# Altium project Motor-42.PrjPCB
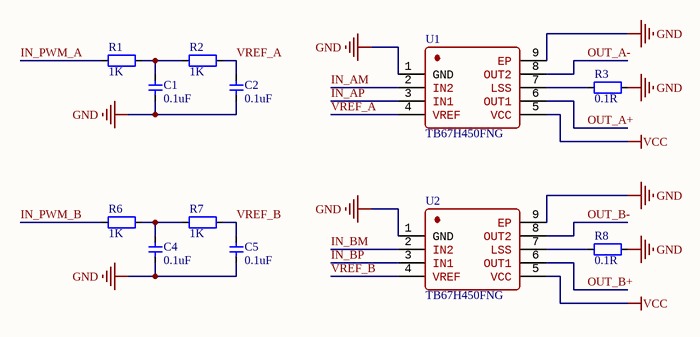
[diagram p0: Drive.SchDoc]
5 sheets, 59 parts. Net scope: global (net labels, ports and power ports of the same name join across sheets).
Board file: Motor-42.PcbDoc
Sheets:
  Drive.SchDoc
  MCU.SchDoc
  Port.SchDoc
  Power.SchDoc
  Interface.SchDoc

## Sheet Drive.SchDoc
size 177 x 101 mm; SheetNumber: 1; SheetTotal: 1

### Parts
C1  0.1uF  [CAP_0402]
C2  0.1uF  [CAP_0402]
C4  0.1uF  [CAP_0402]
C5  0.1uF  [CAP_0402]
R1  1K  [RES_0402]
R2  1K  [RES_0402]
R3  0.1R  [1206-RES]
R6  1K  [RES_0402]
R7  1K  [RES_0402]
R8  0.1R  [1206-RES]
U1  TB67H450FNG  [SO-8-PAD]
U2  TB67H450FNG  [SO-8-PAD]

### Nets
GND: C1.1 C2.1 C4.1 C5.1 R3.2 R8.2 U1.1(GND) U1.9(EP) U2.1(GND) U2.9(EP)
VCC: U1.5(VCC) U2.5(VCC)
IN_AM: U1.2(IN2)
IN_AP: U1.3(IN1)
IN_BM: U2.2(IN2)
IN_BP: U2.3(IN1)
IN_PWM_A: R1.1
IN_PWM_B: R6.1
OUT_A+: U1.6(OUT1)
OUT_A-: U1.8(OUT2)
OUT_B+: U2.6(OUT1)
OUT_B-: U2.8(OUT2)
VREF_A: C2.2 R2.2 U1.4(VREF)
VREF_B: C5.2 R7.2 U2.4(VREF)
NetC1_2: C1.2 R1.2 R2.1
NetC4_2: C4.2 R6.2 R7.1
NetR3_1: R3.1 U1.7(LSS)
NetR8_1: R8.1 U2.7(LSS)

### Library data of the parts
C1 C2 C4 C5 = 电容-0402: Capacitor; Value: 0.1u
R1 R2 R6 R7 = 电阻-0402: Resistor; Value: 22R
R3 R8 = 电阻-1206: Resistor; Value: 22R
U1 U2 = TB67H450FNG: PWM Chopper Type DC Brushed Motor Driver

## Sheet MCU.SchDoc
size 177 x 114 mm; SheetNumber: 1; SheetTotal: 1
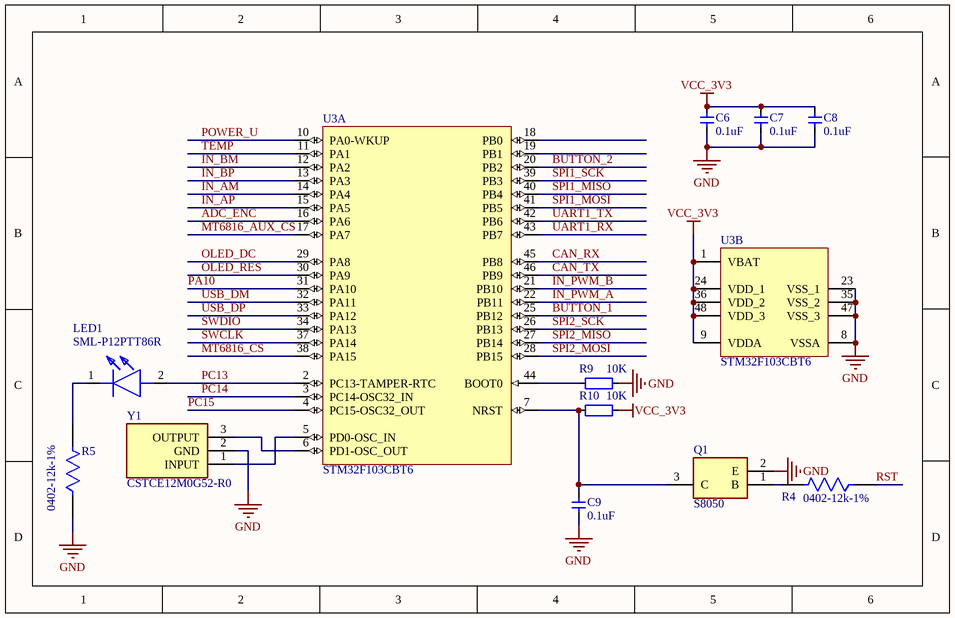
[diagram p1: MCU.SchDoc]

### Parts
C6  0.1uF  [CAP_0402]
C7  0.1uF  [CAP_0402]
C8  0.1uF  [CAP_0402]
C9  0.1uF  [CAP_0402]
LED1  SML-P12PTT86R  [LEDC1006X25N]
Q1  S8050  [SOT95P240X115-3N]
R4  0402-12k-1%  [FP-CRCW0402-e3-IPC_C]
R5  0402-12k-1%  [FP-CRCW0402-e3-IPC_C]
R9  10K  [RES_0402]
R10  10K  [RES_0402]
U3  STM32F103CBT6  [LQFP-48]  (parts A,B of 2)
Y1  CSTCE12M0G52-R0  [CSTCE12M0G52R0]

### Nets
GND: C6.1 C7.1 C8.1 C9.1 Q1.2(E) R5.1 R9.2 U3.8(VSSA) U3.23(VSS_1) U3.35(VSS_2) U3.47(VSS_3) Y1.2(GND)
VCC_3V3: C6.2 C7.2 C8.2 R10.2 U3.1(VBAT) U3.9(VDDA) U3.24(VDD_1) U3.36(VDD_2) U3.48(VDD_3)
ADC_ENC: U3.16(PA6)
BUTTON_1: U3.25(PB12)
BUTTON_2: U3.20(PB2)
CAN_RX: U3.45(PB8)
CAN_TX: U3.46(PB9)
IN_AM: U3.14(PA4)
IN_AP: U3.15(PA5)
IN_BM: U3.12(PA2)
IN_BP: U3.13(PA3)
IN_PWM_A: U3.22(PB11)
IN_PWM_B: U3.21(PB10)
MT6816_AUX_CS: U3.17(PA7)
MT6816_CS: U3.38(PA15)
OLED_DC: U3.29(PA8)
OLED_RES: U3.30(PA9)
PA10: U3.31(PA10)
PC13: LED1.2(A) U3.2(PC13-TAMPER-RTC)
PC14: U3.3(PC14-OSC32_IN)
PC15: U3.4(PC15-OSC32_OUT)
POWER_U: U3.10(PA0-WKUP)
RST: R4.1
SPI1_MISO: U3.40(PB4)
SPI1_MOSI: U3.41(PB5)
SPI1_SCK: U3.39(PB3)
SPI2_MISO: U3.27(PB14)
SPI2_MOSI: U3.28(PB15)
SPI2_SCK: U3.26(PB13)
SWCLK: U3.37(PA14)
SWDIO: U3.34(PA13)
TEMP: U3.11(PA1)
UART1_RX: U3.43(PB7)
UART1_TX: U3.42(PB6)
USB_DM: U3.32(PA11)
USB_DP: U3.33(PA12)
NetC9_2: C9.2 Q1.3(C) R10.1 U3.7(NRST)
NetLED1_1: LED1.1(K) R5.2
NetQ1_1: Q1.1(B) R4.2
NetR9_1: R9.1 U3.44(BOOT0)
NetU3_5: U3.5(PD0-OSC_IN) Y1.1(INPUT)
NetU3_6: U3.6(PD1-OSC_OUT) Y1.3(OUTPUT)

Not connected (* = marked no-connect by the designer): U3 18(PB0) 19(PB1)

### Library data of the parts
C6-C9 = 电容-0402: Capacitor; Value: 0.1u
LED1 = SML-P12PTT86R: LED; Manufacturer_Name: ROHM Semiconductor; Datasheet Link: https://componentsearchengine.com/Datasheets/2/SML-P12PTT86R.pdf; Height: 0.25mm; Manufacturer_Part_Number: SML-P12PTT86R; Mouser Part Number: 755-SML-P12PTT86R; Mouser Price/Stock: https://www.mouser.co.uk/ProductDetail/ROHM-Semiconductor/SML-P12PTT86R?qs=Ei%2Fnxee9QYifz6HhDm1g1Q%3D%3D
Q1 = S8050: Transistor; Manufacturer_Name: Yenji Elec; Datasheet Link: https://datasheet.lcsc.com/szlcsc/Yenji-Elec-S8050_C139514.pdf; Height: 1.15mm; Manufacturer_Part_Number: S8050
R4 R5 = CMP-2002-08122-2: RES Thick Film, 0Ω, 0.063W, 0402; Tolerance: 5%; Max Power Dissipation: 63mW; Voltage Rating: 50V; Temperature Coefficient: 100ppm/°C; Resistance: 0mR; Contact Plating: Tin; Height: 0.35mm; Radiation Hardening: No; Features: Automotive AEC-Q200; Composition: Thick Film; Width: 0.5mm; Weight: 2.3E-05oz; Termination: SMD/SMT; Packaging: Tape and Reel; Mount: Surface Mount; Case Code (Metric): 1005; Military Standard: Not; Min Operating Temperature: -55°C; Number of Terminations: 2; Package Quantity: 1; Case Code (Imperial): 0402; Depth: 0.5mm; Max Operating Temperature: 155°C; Case/Package: 0402; Power Rating: 63mW; Lead Free: Lead Free; Voltage Rating (DC): 50V; Length: 1mm
R9 R10 = 电阻-0402: Resistor; Value: 22R
U3 = STM32F103CBT6: ARM Cortex-M3 32-bit MCU, 128 KB Flash, 20 KB Internal RAM, 37 I/Os, 48-pin LQFP, -40 to 85 degC, Tray; A/D Converter: 2x12-bit (10 Channel); FLASH Size (Prog) (kB): 128; I/Os (High Current): 37; Internal RAM Size (kB): 20; Operating Frequency(F) (Processor speed) (MHz): 72; Supply Voltage(Vcc) min (V): 2; DatasheetVersion: Rev. 16; PackageVersion: Rev. 6, 06/2013; PackageReference: LQFP48; PackageDescription: 48-Pin Low Profile Quad Flat Package, 7 x 7 mm Body, 0.5 mm Pitch; Supplier 1: Digi-Key; Supplier Part Number 1: 497-6288-ND; Supplier 2: Farnell; Supplier Part Number 2: 1606327; Supplier 3: Newark; Supplier Part Number 3: 11N8296; Supplier 4: Newark; Supplier Part Number 4: 57P1214; Supplier 5: Mouser; Supplier Part Number 5: 511-STM32F103CBT6; Core: ARM Cortex-M3; Packing: Tray; Mounting Technology: Surface Mount; PartNumber: STM32F103CBT6; ComponentLink1Description: Manufacturer URL; ComponentLink1URL: http://www.st.com/web/en/home.html; ComponentLink2Description: Datasheet; ComponentLink2URL: http://www.st.com/st-web-ui/static/active/en/resource/technical/document/datasheet/CD00161566.pdf; ComponentLink3Description: Package Specification; ComponentLink3URL: http://www.st.com/st-web-ui/static/active/en/resource/technical/document/datasheet/DM00058181.pdf
Y1 = CSTCE12M0G52-R0: Crystal or Oscillator; Manufacturer_Name: Murata Electronics; Datasheet Link: https://www.murata.com/en-global/products/productdata/8801428045854/SPEC-CSTNE12M0G520000R0.pdf; Height: 0.8mm; Manufacturer_Part_Number: CSTCE12M0G52-R0; Mouser Part Number: 81-CSTCE12M0G52-R0; Mouser Price/Stock: https://www.mouser.co.uk/ProductDetail/Murata-Electronics/CSTCE12M0G52-R0?qs=krk%2F6UQjCzAB%2F8ExIYkEwQ%3D%3D; Arrow Part Number: CSTCE12M0G52-R0; Arrow Price/Stock: https://www.arrow.com/en/products/cstce12m0g52-r0/murata-manufacturing

## Sheet Port.SchDoc
size 177 x 165 mm; SheetNumber: 1; SheetTotal: 1
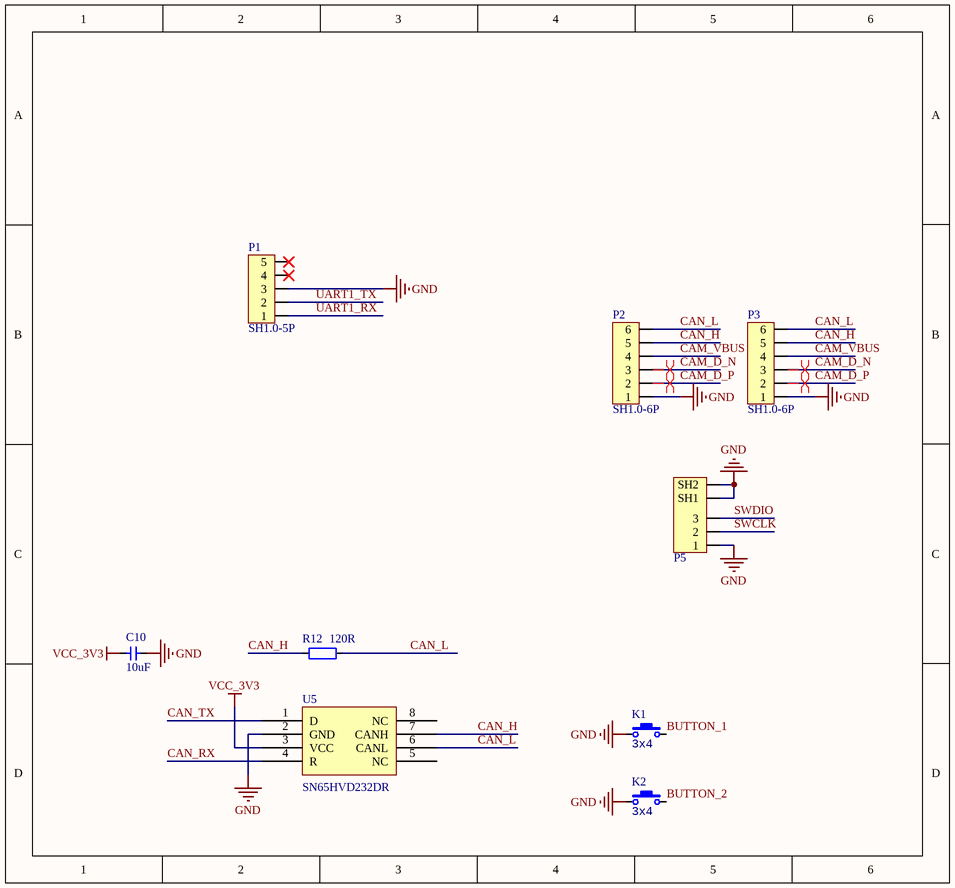
[diagram p2: Port.SchDoc]

### Parts
C10  10uF  [CAP_0402]
K1  value 3x4  [ButtonTACT_3x4x2_180]  (hidden comment: TACT 2P)
K2  value 3x4  [ButtonTACT_3x4x2_180]  (hidden comment: TACT 2P)
P1  SH1.0-5P  [SH1.0-5P]
P2  SH1.0-6P  [SH1.0-6P]
P3  SH1.0-6P  [SH1.0-6P]
P5  SH1.0-3P  [SH1.0-3P]  (value not drawn)
R12  120R  [RES_0402]
U5  Manufacturer Part Number: SN65HVD232DR  [SO-8]  (hidden comment: SN65HVD232D)

### Nets
GND: C10.1 K1.1 K2.1 P1.3 P2.1 P3.1 P5.1 P5.SH1 P5.SH2 U5.2(GND)
VCC_3V3: C10.2 U5.3(VCC)
BUTTON_1: K1.2
BUTTON_2: K2.2
CAM_D_N: P2.3 P3.3
CAM_D_P: P2.2 P3.2
CAM_VBUS: P2.4 P3.4
CAN_H: P2.5 P3.5 R12.1 U5.7(CANH)
CAN_L: P2.6 P3.6 R12.2 U5.6(CANL)
CAN_RX: U5.4(R)
CAN_TX: U5.1(D)
SWCLK: P5.2
SWDIO: P5.3
UART1_RX: P1.1
UART1_TX: P1.2

Not connected (* = marked no-connect by the designer): P1 4* 5*; U5 5(NC) 8(NC)

### Layout directives
differential pair: CAM_D_N, CAM_D_P

### Library data of the parts
C10 = 电容-0402: Capacitor; Value: 0.1u
K1 K2 = ButtonTACT_3x4x2_180: Button; type: TACT 2P
P5 = SH1.0-3P: Header
R12 = 电阻-0402: Resistor; Value: 22R
U5 = SN65HVD232D: Manufacturer: Texas Instruments; Protocol: CAN; Number of Drivers/Receivers: 1/1; Duplex: Half; Data Rate: 1Mbps; Voltage - Supply: 3 V ~ 3.6 V; Supplier 1: Digi-Key; Supplier Part Number 1: 296-26344-2-ND; RoHS: RoHS Compliant; Category: Integrated Circuits (ICs); Stock: 5000; Pricing 1: 2500=0.84375 (USD); Packaging: Tape & Reel (TR); Part Status: Active; Type: Transceiver; Operating Temperature: -40°C ~ 85°C; Mounting Type: Surface Mount; Package / Case: 8-SOIC (0.154", 3.90mm Width); Supplier Device Package: 8-SOIC; ComponentLink1URL: http://www.ti.com/lit/ds/symlink/sn65hvd230.pdf; ComponentLink1Description: http://www.ti.com/lit/ds/symlink/sn65hvd230.pdf; Supplier 2: Digi-Key; Supplier Part Number 2: 296-26344-1-ND; Pricing 2: 1=2.05, 10=1.842, 100=1.4809, 500=1.21668, 1000=1.00811 (USD)

## Sheet Power.SchDoc
size 127 x 165 mm; SheetNumber: 1; SheetTotal: 1
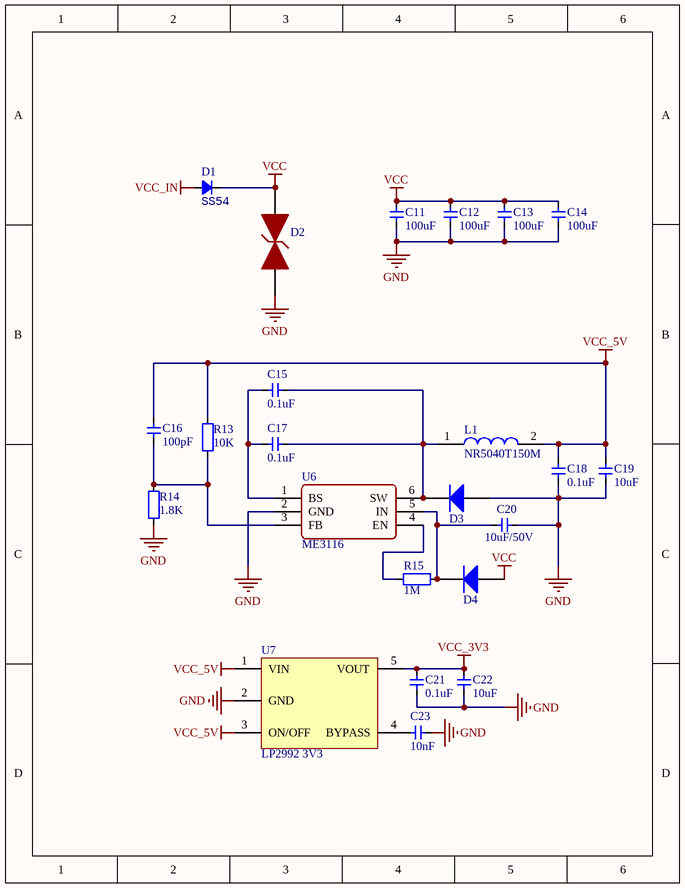
[diagram p3: Power.SchDoc]

### Parts
C11  100uF  [1206-CAP]
C12  100uF  [1206-CAP]
C13  100uF  [1206-CAP]
C14  100uF  [1206-CAP]
C15  0.1uF  [CAP_0402]
C16  100pF  [CAP_0402]
C17  0.1uF  [CAP_0402]
C18  0.1uF  [CAP_0402]
C19  10uF  [CAP_0402]
C20  10uF/50V  [CAP_0402]
C21  0.1uF  [CAP_0402]
C22  10uF  [CAP_0402]
C23  10nF  [CAP_0402]
D1  SS54  [DO-214AC]
D2  SMBJ28CA  [SMBJ-CA_MFG]  (value not drawn)
D3  二极管-5819W  [SOD-323]  (value not drawn)
D4  二极管-5819W  [SOD-323]  (value not drawn)
L1  NR5040T150M  [NR5040T150M]
R13  10K  [RES_0402]
R14  1.8K  [RES_0402]
R15  1M  [RES_0402]
U6  ME3116  [SOT23-6]
U7  LP2992 3V3  [SOT23-5]

### Nets
GND: C11.1 C12.1 C13.1 C14.1 C18.1 C19.1 C20.1 C21.1 C22.1 C23.1 D2.1 D3.1(A) R14.1 U6.2(GND) U7.2(GND)
VCC: C11.2 C12.2 C13.2 C14.2 D1.2(K) D2.2 D4.1(A)
VCC_3V3: C21.2 C22.2 U7.5(VOUT)
VCC_5V: C16.1 C18.2 C19.2 L1.2 R13.2 U7.1(VIN) U7.3(ON/OFF)
VCC_IN: D1.1(A)
NetC15_1: C15.1 C17.1 D3.2(K) L1.1 U6.6(SW)
NetC15_2: C15.2 C17.2 U6.1(BS)
NetC16_2: C16.2 R13.1 R14.2 U6.3(FB)
NetC20_2: C20.2 D4.2(K) R15.1 U6.5(IN)
NetC23_2: C23.2 U7.4(BYPASS)
NetR15_2: R15.2 U6.4(EN)

### Library data of the parts
C11-C14 = 电容-1206: Capacitor; Value: 0.1u
C15-C23 = 电容-0402: Capacitor; Value: 0.1u
D1 = Diode_SMA: Diode; Type: SMA; Value: SS54
D3 D4 = 二极管-5819W: 40V
L1 = NR5040T150M: Inductor; Manufacturer_Name: TAIYO YUDEN; Datasheet Link: https://www.arrow.com/en/products/nr5040t150m/taiyo-yuden; Height: 4mm; Manufacturer_Part_Number: NR5040T150M; Mouser Part Number: 963-NR5040T150M; Mouser Price/Stock: https://www.mouser.co.uk/ProductDetail/TAIYO-YUDEN/NR5040T150M?qs=PzICbMaShUfy55J2e2ZihQ%3D%3D; Arrow Part Number: NR5040T150M; Arrow Price/Stock: https://www.arrow.com/en/products/nr5040t150m/taiyo-yuden
R13-R15 = 电阻-0402: Resistor; Value: 22R
U6 = ME3116: DC-DC
U7 = LP2992: LDO

## Sheet Interface.SchDoc
size 203 x 165 mm; SheetNumber: 1; SheetTotal: 1
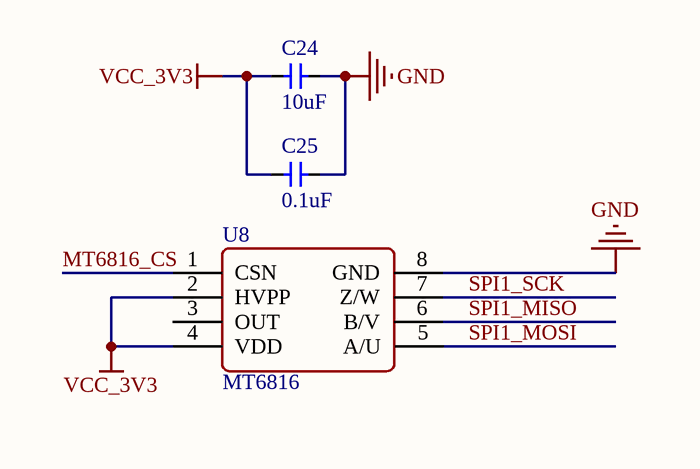
[diagram p4: Interface.SchDoc]

### Parts
C24  10uF  [CAP_0402]
C25  0.1uF  [CAP_0402]
U8  MT6816  [SO-8]

### Nets
GND: C24.1 C25.1 U8.8(GND)
VCC_3V3: C24.2 C25.2 U8.2(HVPP) U8.4(VDD)
MT6816_CS: U8.1(CSN)
SPI1_MISO: U8.6(B/V)
SPI1_MOSI: U8.5(A/U)
SPI1_SCK: U8.7(Z/W)

Not connected (* = marked no-connect by the designer): U8 3(OUT)

### Library data of the parts
C24 C25 = 电容-0402: Capacitor; Value: 0.1u
U8 = MT6816: Magnetic Position Sensor

## Nets that join several sheets
GND: Drive (10 pins), MCU (12 pins), Port (10 pins), Power (15 pins), Interface (C24.1 C25.1 U8.8)
VCC: Drive (U1.5 U2.5), Power (7 pins)
VCC_3V3: MCU (9 pins), Port (C10.2 U5.3), Power (C21.2 C22.2 U7.5), Interface (C24.2 C25.2 U8.2 U8.4)
BUTTON_1: MCU (U3.25), Port (K1.2)
BUTTON_2: MCU (U3.20), Port (K2.2)
CAN_RX: MCU (U3.45), Port (U5.4)
CAN_TX: MCU (U3.46), Port (U5.1)
IN_AM: Drive (U1.2), MCU (U3.14)
IN_AP: Drive (U1.3), MCU (U3.15)
IN_BM: Drive (U2.2), MCU (U3.12)
IN_BP: Drive (U2.3), MCU (U3.13)
IN_PWM_A: Drive (R1.1), MCU (U3.22)
IN_PWM_B: Drive (R6.1), MCU (U3.21)
MT6816_CS: MCU (U3.38), Interface (U8.1)
SPI1_MISO: MCU (U3.40), Interface (U8.6)
SPI1_MOSI: MCU (U3.41), Interface (U8.5)
SPI1_SCK: MCU (U3.39), Interface (U8.7)
SWCLK: MCU (U3.37), Port (P5.2)
SWDIO: MCU (U3.34), Port (P5.3)
UART1_RX: MCU (U3.43), Port (P1.1)
UART1_TX: MCU (U3.42), Port (P1.2)